# Altium schematic sheet DRAM_TEMP_AD.schdoc
size 302 x 215 mm
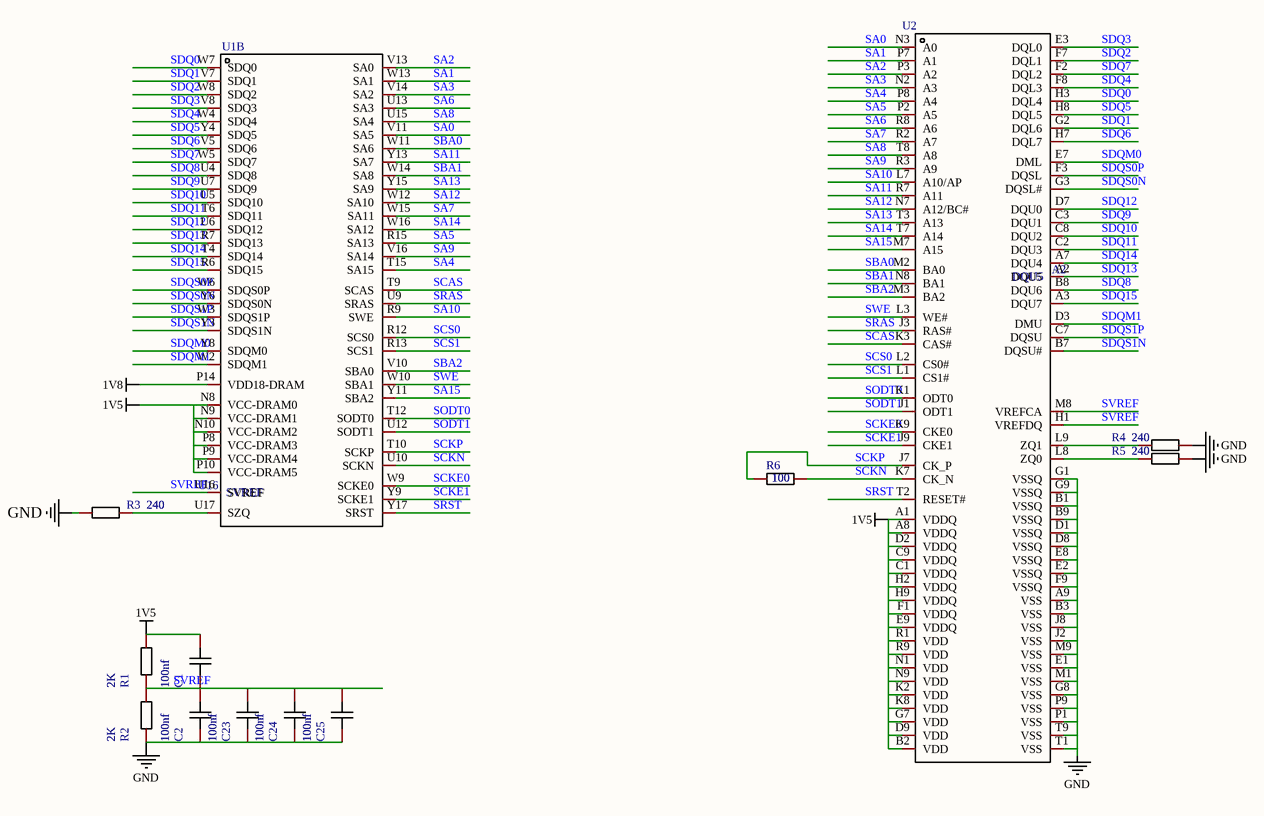
[diagram p0: DRAM_TEMP_AD.schdoc]

## Parts
C1  100nf
C2  100nf
C23  100nf
C24  100nf
C25  100nf
R1  2K
R2  2K
R3  240
R4  240
R5  240
R6  100
U1  NAME: SVREF  NUMBER: U16  [ALLWINNER D1]  (part B of 10)
U2  NAME: DQU5  NUMBER: A2

## Nets
1V5: C1.2 R1.2 U1.N8(VCC-DRAM0) U1.N9(VCC-DRAM1) U1.N10(VCC-DRAM2) U1.P8(VCC-DRAM3) U1.P9(VCC-DRAM4) U1.P10(VCC-DRAM5) U2.A1(VDDQ) U2.A8(VDDQ) U2.B2(VDD) U2.C1(VDDQ) U2.C9(VDDQ) U2.D2(VDDQ) U2.D9(VDD) U2.E9(VDDQ) U2.F1(VDDQ) U2.G7(VDD) U2.H2(VDDQ) U2.H9(VDDQ) U2.K2(VDD) U2.K8(VDD) U2.N1(VDD) U2.N9(VDD) U2.R1(VDD) U2.R9(VDD)
1V8: U1.P14(VDD18-DRAM)
GND: C2.1 C23.1 C24.1 C25.1 R2.1 R3.1 R4.2 R5.2 U2.A9(VSS) U2.B1(VSSQ) U2.B3(VSS) U2.B9(VSSQ) U2.D1(VSSQ) U2.D8(VSSQ) U2.E1(VSS) U2.E2(VSSQ) U2.E8(VSSQ) U2.F9(VSSQ) U2.G1(VSSQ) U2.G8(VSS) U2.G9(VSSQ) U2.J2(VSS) U2.J8(VSS) U2.M1(VSS) U2.M9(VSS) U2.P1(VSS) U2.P9(VSS) U2.T1(VSS) U2.T9(VSS)
SA0: U1.V11(SA5) U2.N3(A0)
SA1: U1.W13(SA1) U2.P7(A1)
SA2: U1.V13(SA0) U2.P3(A2)
SA3: U1.V14(SA2) U2.N2(A3)
SA4: U1.T15(SA15) U2.P8(A4)
SA5: U1.R15(SA13) U2.P2(A5)
SA6: U1.U13(SA3) U2.R8(A6)
SA7: U1.W15(SA11) U2.R2(A7)
SA8: U1.U15(SA4) U2.T8(A8)
SA9: U1.V16(SA14) U2.R3(A9)
SA10: U1.R9(SWE) U2.L7(A10/AP)
SA11: U1.Y13(SA7) U2.R7(A11)
SA12: U1.W12(SA10) U2.N7(A12/BC#)
SA13: U1.Y15(SA9) U2.T3(A13)
SA14: U1.W16(SA12) U2.T7(A14)
SA15: U1.Y11(SBA2) U2.M7(A15)
SBA0: U1.W11(SA6) U2.M2(BA0)
SBA1: U1.W14(SA8) U2.N8(BA1)
SBA2: U1.V10(SBA0) U2.M3(BA2)
SCAS: U1.T9(SCAS) U2.K3(CAS#)
SCKE0: U1.W9(SCKE0) U2.K9(CKE0)
SCKE1: U1.Y9(SCKE1) U2.J9(CKE1)
SCKN: R6.2 U1.U10(SCKN) U2.K7(CK_N)
SCKP: R6.1 U1.T10(SCKP) U2.J7(CK_P)
SCS0: U1.R12(SCS0) U2.L2(CS0#)
SCS1: U1.R13(SCS1) U2.L1(CS1#)
SDQ0: U1.W7(SDQ0) U2.H3(DQL4)
SDQ1: U1.V7(SDQ1) U2.G2(DQL6)
SDQ2: U1.W8(SDQ2) U2.F7(DQL1)
SDQ3: U1.V8(SDQ3) U2.E3(DQL0)
SDQ4: U1.W4(SDQ4) U2.F8(DQL3)
SDQ5: U1.Y4(SDQ5) U2.H8(DQL5)
SDQ6: U1.V5(SDQ6) U2.H7(DQL7)
SDQ7: U1.W5(SDQ7) U2.F2(DQL2)
SDQ8: U1.U4(SDQ8) U2.B8(DQU6)
SDQ9: U1.U7(SDQ9) U2.C3(DQU1)
SDQ10: U1.U5(SDQ10) U2.C8(DQU2)
SDQ11: U1.T6(SDQ11) U2.C2(DQU3)
SDQ12: U1.U6(SDQ12) U2.D7(DQU0)
SDQ13: U1.R7(SDQ13) U2.A2(DQU5)
SDQ14: U1.T4(SDQ14) U2.A7(DQU4)
SDQ15: U1.R6(SDQ15) U2.A3(DQU7)
SDQM0: U1.Y8(SDQM0) U2.E7(DML)
SDQM1: U1.W2(SDQM1) U2.D3(DMU)
SDQS0N: U1.Y6(SDQS0N) U2.G3(DQSL#)
SDQS0P: U1.W6(SDQS0P) U2.F3(DQSL)
SDQS1N: U1.Y3(SDQS1N) U2.B7(DQSU#)
SDQS1P: U1.W3(SDQS1P) U2.C7(DQSU)
SODT0: U1.T12(SODT0) U2.K1(ODT0)
SODT1: U1.U12(SODT1) U2.J1(ODT1)
SRAS: U1.U9(SRAS) U2.J3(RAS#)
SRST: U1.Y17(SRST) U2.T2(RESET#)
SVREF: C1.1 C2.2 C23.2 C24.2 C25.2 R1.1 R2.2 U1.U16(SVREF) U2.H1(VREFDQ) U2.M8(VREFCA)
SWE: U1.W10(SBA1) U2.L3(WE#)
NetR3_2: R3.2 U1.U17(SZQ)
NetR4_1: R4.1 U2.L9(ZQ1)
NetR5_1: R5.1 U2.L8(ZQ0)

## Library data of the parts
C1 = C0402_1: Symbol: C0402; Convert to PCB: yes; Name: 100nf; Device: C0402_1; Add into BOM: yes
C2 C23-C25 = C0402_2: Symbol: C0402; Convert to PCB: yes; Name: 100nf; Device: C0402_2; Add into BOM: yes
R1 = R0402_1_1: Symbol: R0402; Convert to PCB: yes; Name: 2K; Device: R0402_1_1; Add into BOM: yes
R2-R6 = R0402_1: Symbol: R0402; Convert to PCB: yes; Device: R0402_1; Add into BOM: yes
  R2: Name: 2K
  R3-R5: Name: 240
  R6: Name: 100
U1 = Allwinner D1-H: Pin Type: IN; Add into BOM: yes; Symbol: Allwinner D1-H; Device: Allwinner D1-H; Supplier: Digi-Key; Convert to PCB: yes
U2 = H5TQ4G63EFR-RDC_1: Manufacturer: HYNIX(海力士); Pin Type: IN; Add into BOM: yes; Symbol: H5TQ4G63EFR-RDC; Device: H5TQ4G63EFR-RDC_1; Supplier: LCSC; Supplier Part: C2803259; Manufacturer Part: H5TQ4G63EFR-RDC; Convert to PCB: yes